# EAGLE design temp_sensor (EAGLE 7.7.0)
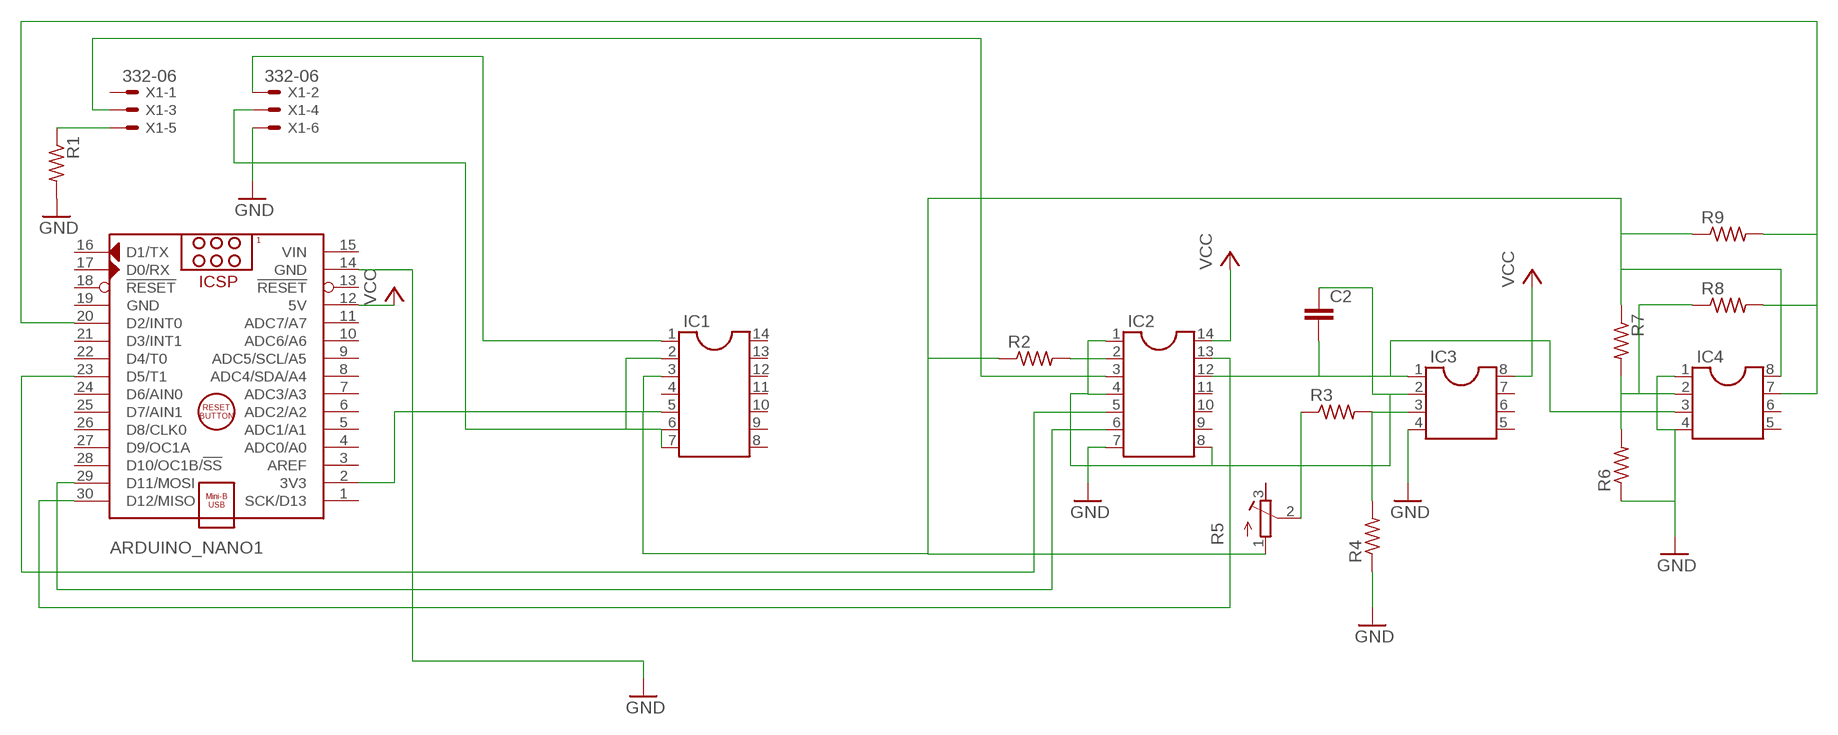
[diagram p0: schematic, sheet 1]

## Parts
ARDUINO_NANO1  ARDUINO_NANO  [ARDUINO_NANO]
C2  C5/2.5  [C5B2.5]
IC1  DIL14  [DIL14]
IC2  DIL14  [DIL14]
IC3  DIL8  [DIL08]
IC4  DIL8  [DIL08]
R1  R-US_0207/10  [0207/10]
R2  R-US_0207/10  [0207/10]
R3  R-US_0207/10  [0207/10]
R4  R-US_0207/10  [0207/10]
R5  R-TRIMM3299W  [RTRIM3299W]
R6  R-US_0207/10  [0207/10]
R7  R-US_0207/10  [0207/10]
R8  R-US_0207/10  [0207/10]
R9  R-US_0207/10  [0207/10]
X1  332-06  [332-06]

## Nets
GND: ARDUINO_NANO1.14(GND) IC2.7 IC3.4 IC4.1 IC4.4 R1.2 R4.1 R6.1 X1.6
N$1: IC1.1 X1.2
N$2: ARDUINO_NANO1.2(3V3) IC1.3 IC1.5 IC4.8 R2.1 R5.1(A) R7.1 R9.1
N$3: IC1.2 IC1.6 IC1.7 X1.4
N$4: ARDUINO_NANO1.23(D5/T1) IC2.5
N$5: R1.1 X1.5
N$6: IC2.3 X1.3
N$7: ARDUINO_NANO1.30(D12/MISO) IC2.13
N$8: ARDUINO_NANO1.29(D11/MOSI) IC2.6
N$9: C2.1 IC2.1 IC2.4 IC2.8 IC3.2
N$10: C2.2 IC2.12 IC3.1 IC4.3
N$11: IC2.2 R2.2
N$12: IC3.3 R3.2 R4.2
N$13: R3.1 R5.2(S)
N$14: IC4.2 R6.2 R7.2 R8.1
N$17: ARDUINO_NANO1.20(D2/INT0) IC4.7 R8.2 R9.2
VCC: ARDUINO_NANO1.12(5V) IC2.14 IC3.8
Unconnected: ARDUINO_NANO1.1(SCK/D13) ARDUINO_NANO1.3(AREF) ARDUINO_NANO1.4(ADC0/A0) ARDUINO_NANO1.5(ADC1/A1) ARDUINO_NANO1.6(ADC2/A2) ARDUINO_NANO1.7(ADC3/A3) ARDUINO_NANO1.8(ADC4/SDA/A4) ARDUINO_NANO1.9(ADC5/SCL/A5) ARDUINO_NANO1.10(ADC6/A6) ARDUINO_NANO1.11(ADC7/A7) ARDUINO_NANO1.13(!RESET) ARDUINO_NANO1.16(D1/TX) ARDUINO_NANO1.17(D0/RX) ARDUINO_NANO1.18(!RESET) ARDUINO_NANO1.21(D3/INT1) ARDUINO_NANO1.22(D4/T0) ARDUINO_NANO1.24(D6/AIN0) ARDUINO_NANO1.25(D7/AIN1) ARDUINO_NANO1.26(D8/CLK0) ARDUINO_NANO1.27(D9/OC1A) ARDUINO_NANO1.28(D10/OC1B/!SS) IC1.4 IC1.8 IC1.9 IC1.10 IC1.11 IC1.12 IC1.13 IC1.14 IC2.9 IC2.10 IC2.11 IC3.5 IC3.6 IC3.7 IC4.5 IC4.6 R5.3(E) X1.1

## Power pins joined to a net without a drawn wire
GND: ARDUINO_NANO1.19(GND)
VIN: ARDUINO_NANO1.15(VIN)

## Library data of the parts
ARDUINO_NANO1 = 6301-temp-sensor-rev1:ARDUINO_NANO: Arduino Nano V3.0 Module Overview: The Arduino Nano is a small, complete, and breadboard-friendly board based on the ATmega328 (Arduino Nano 3.x) or ATmega168 (Arduino Nano 2.x). It has more or less the same functionality of the Arduino Duemilanove, but in a different package. It lacks only a DC power jack, and works with a Mini-B USB cable instead of a standard one. The Nano was designed and is being produced by Gravitech <http://www.gravitech.us/arna30wiatp.html>. General specifications: Item Value Microcontroller Atmel ATmega168 or ATmega328 Operating Voltage (logic level) 5 V Input Voltage (recommended) 7-12 V Input Voltage (limits) 6-20 V Digital I/O Pins 14 (of which 6 provide PWM output) Analog Input Pins 8 DC Current per I/O Pin 40 mA Flash Memory 16 KB (ATmega168) or 32 KB (ATmega328) of which 2 KB used by bootloader SRAM 1 KB (ATmega168) or 2 KB (ATmega328) EEPROM 512 bytes (ATmega168) or 1 KB (ATmega328) Clock Speed 16 MHz Dimensions (Inches) 0.73" x 1.70" Dimensions (mm) 18mm x 45mm Overall height About 9 mm (not including pins) Weigth 5 g Power: The Arduino Nano can be powered via the Mini-B USB connection, 6-20V unregulated external power supply (pin 30), or 5V regulated external power supply (pin 27). The power source is automatically selected to the highest voltage source. Memory: The ATmega168 has 16 KB of flash memory for storing code (of which 2 KB is used for the bootloader); the ATmega328 has 32 KB, (also with 2 KB used for the bootloader). The ATmega168 has 1 KB of SRAM and 512 bytes of EEPROM (which can be read and written with the EEPROM library); the ATmega328 has 2 KB of SRAM and 1 KB of EEPROM. Input and Output: Each of the 14 digital pins on the Nano can be used as an input or output, using pinMode(), digitalWrite(), and digitalRead() functions. They operate at 5 volts. Each pin can provide or receive a maximum of 40 mA and has an internal pull-up resistor (disconnected by default) of 20-50 kOhms. In addition, some pins have specialized functions. Visit Arduino - ArduinoBoardNano <https://www.arduino.cc/en/Main/ArduinoBoardNano>
C2 = capacitor-wima:C: CAPACITOR naming: grid - package width
IC1 IC2 = ic-package:DIL14: Dual In Line / Socket
IC3 IC4 = ic-package:DIL8: Dual In Line / Socket
R1 R2 = resistor:R-US_: RESISTOR, American symbol
R3 R4 R6-R9 = rcl:R-US_: RESISTOR, American symbol
R5 = rcl:R-TRIMM: Trimm resistor
X1 = con-garry:332-06: 6 Pin - 2mm Dual Row Source: www.mpe-connector.de / garry_shortform_2012.pdf

## Net classes
0 default: width 0.305 mm, drill 0.508 mm, clearance 0.254 mm

## Board
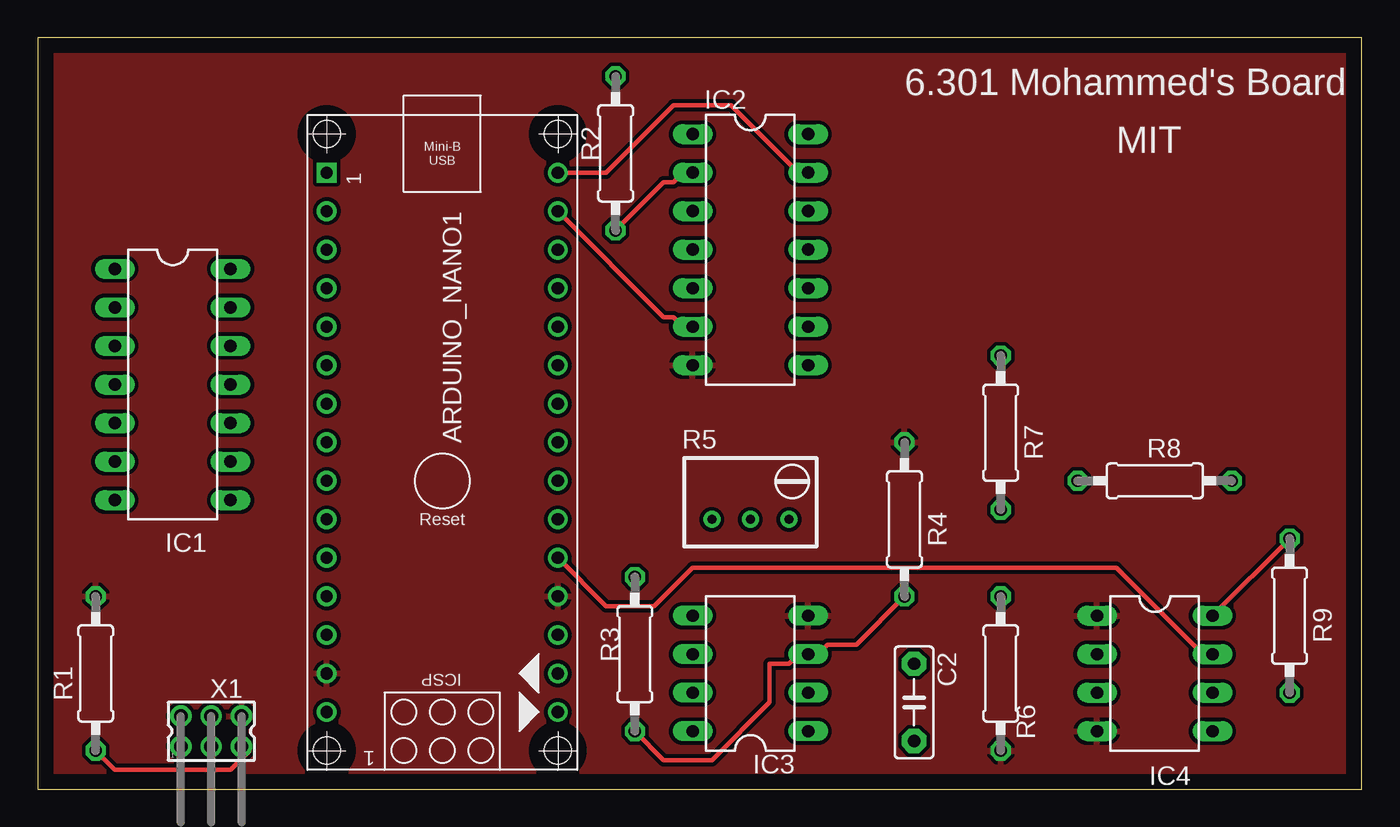
[diagram p1: board, top side]
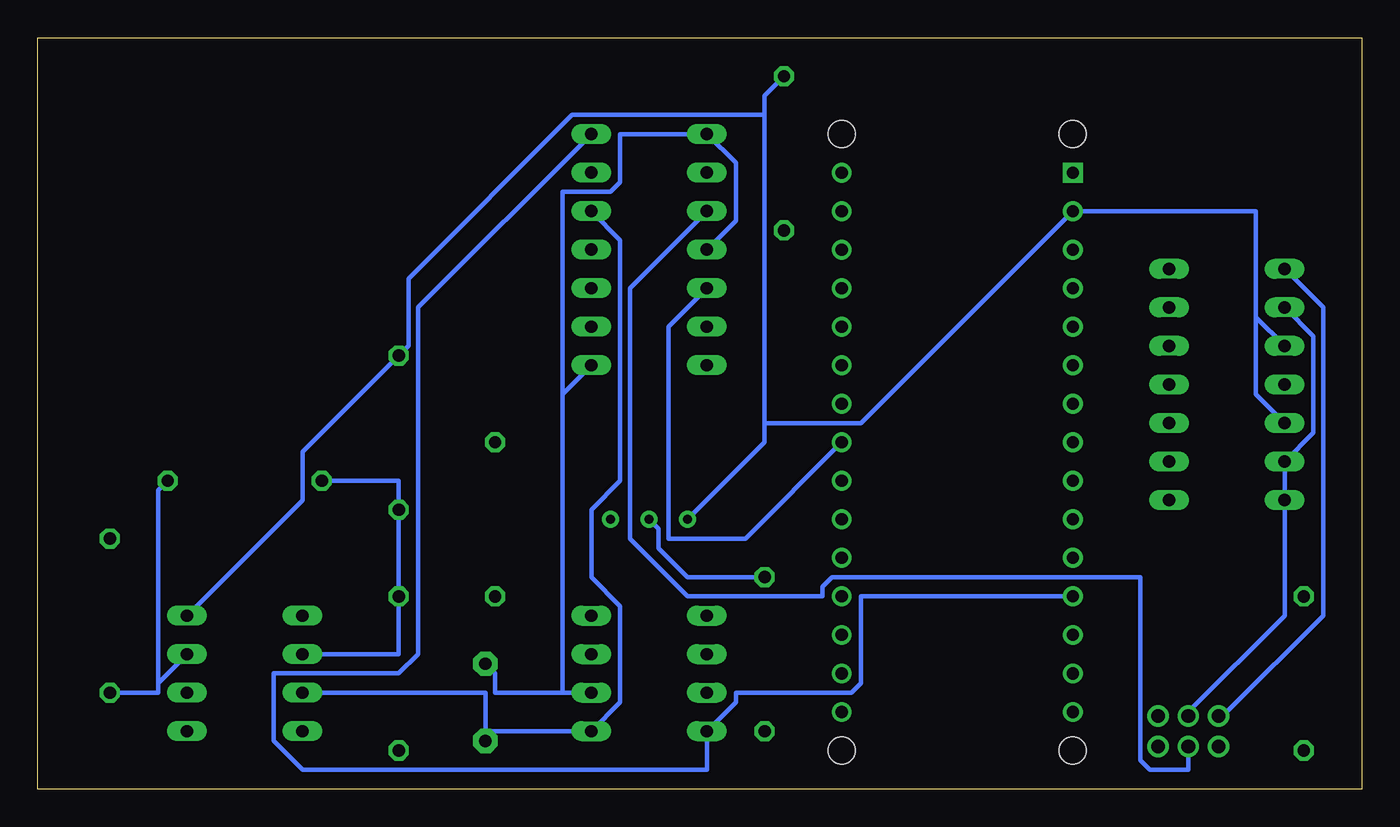
[diagram p2: board, bottom side, seen from below]

Size 87.3 x 49.52 mm. Coordinates in mm from the lower left corner, seen from the top.
Outline: 0,0 87.3,0 87.3,49.52 0,49.52 0,0
Copper layers (1*16): Top 0.035mm / dielectric 1.5mm / Bottom 0.035mm
Design rules "default": minimum track width 10mil, minimum drill 24mil, track to track 8mil, track to pad 8mil, pad to pad 8mil, via to via 8mil, smd to smd 8mil, copper to edge 40mil, drill to drill 8mil, minimum pad ring 10mil, minimum via ring 8mil, stop-mask expansion 4mil, vias tented up to drill 0mil, thermal gap 10mil

### Footprints (pad centres in the part's own frame; a part is rotated, then mirrored left to right if it is on the bottom)
ARDUINO_NANO = drill 0.8 square: 1 -20.32,-7.62 | drill 0.8: 2 -17.78,-7.62; 3 -15.24,-7.62; 4 -12.7,-7.62; 5 -10.16,-7.62; 6 -7.62,-7.62; 7 -5.08,-7.62; 8 -2.54,-7.62; 9 0,-7.62; 10 2.54,-7.62; 11 5.08,-7.62; 12 7.62,-7.62; 13 10.16,-7.62; 14 12.7,-7.62; 15 15.24,-7.62; 16 15.24,7.62; 17 12.7,7.62; 18 10.16,7.62; 19 7.62,7.62; 20 5.08,7.62; 21 2.54,7.62; 22 0,7.62; 23 -2.54,7.62; 24 -5.08,7.62; 25 -7.62,7.62; 26 -10.16,7.62; 27 -12.7,7.62; 28 -15.24,7.62; 29 -17.78,7.62; 30 -20.32,7.62 | hole 1.778: -22.86,-7.62; -22.86,7.62; 17.78,7.62; 17.78,-7.62
C5B2.5 = drill 0.813 pad 1.6 octagon: 1 -2.54,0; 2 2.54,0
DIL14 = drill 0.813 long: 1 -7.62,-3.81; 2 -5.08,-3.81; 3 -2.54,-3.81; 4 0,-3.81; 5 2.54,-3.81; 6 5.08,-3.81; 7 7.62,-3.81; 8 7.62,3.81; 9 5.08,3.81; 10 2.54,3.81; 11 0,3.81; 12 -2.54,3.81; 13 -5.08,3.81; 14 -7.62,3.81
DIL08 = drill 0.813 long: 1 -3.81,-3.81; 2 -1.27,-3.81; 3 1.27,-3.81; 4 3.81,-3.81; 5 3.81,3.81; 6 1.27,3.81; 7 -1.27,3.81; 8 -3.81,3.81
0207/10 = drill 0.813 octagon: 1 -5.08,0; 2 5.08,0
RTRIM3299W = drill 0.61: 1 1.27,-2.54; 2 1.27,0; 3 1.27,2.54
332-06 = drill 0.9 pad 1.27: 1 -2,-1; 2 -2,1; 3 0,-1; 4 0,1; 5 2,-1; 6 2,1

### Placement (x,y rotation side)
ARDUINO_NANO1  26.67,20.32 270 top
C2  57.78,5.71 270 top
IC1  8.89,26.67 270 top
IC2  46.99,35.56 270 top
IC3  46.99,7.62 90 top
IC4  73.66,7.62 270 top
R1  3.81,7.62 90 top
R2  38.1,41.91 270 top
R3  39.37,8.89 270 top
R4  57.15,17.78 270 top
R5  46.99,19.05 270 top
R6  63.5,7.62 90 top
R7  63.5,23.5 270 top
R8  73.66,20.32 0 top
R9  82.55,11.43 270 top
X1  11.43,3.81 0 top

### Tracks (layer width: path | path; a pad name or v marks a point on that pad's centre or on a via)
GND
  pour Top: -1.27,50.8 88.9,50.8 88.9,-1.27 -1.27,-1.27
N$1
  Bottom 0.305: IC1.1 2.54,31.75 2.54,11.43 8.89,5.08 X1.2
N$2
  Top 0.305: IC4.8 R9.1
  Bottom 0.305: IC4.8 69.85,19.05 69.85,22.23 R7.1 62.87,29.21 62.87,33.66 52.07,44.45 39.37,44.45 | 6.99,31.11 6.99,38.1 ARDUINO_NANO1.2 33.02,24.13 39.37,24.13 | IC1.3 6.99,31.11 | IC1.5 6.99,26.04 6.99,31.11 | R5.1 39.37,22.86 39.37,24.13 | 39.37,44.45 39.37,45.72 R2.1 | 39.37,44.45 39.37,24.13
N$3
  Bottom 0.305: IC1.2 3.17,29.84 3.17,23.5 IC1.6 IC1.7 5.08,11.43 11.43,5.08 X1.4
N$4
  Bottom 0.305: ARDUINO_NANO1.23 40.64,16.51 45.72,16.51 45.72,30.48 IC2.5
N$5
  Top 0.305: R1.1 5.08,1.27 12.7,1.27 13.97,2.54 X1.5
N$6
  Bottom 0.305: IC2.3 48.26,33.02 48.26,16.51 44.45,12.7 35.56,12.7 35.56,13.34 34.92,13.97 14.61,13.97 14.61,1.91 13.97,1.27 11.43,1.27 X1.3
N$7
  Top 0.305: ARDUINO_NANO1.30 37.47,40.64 41.91,45.09 45.72,45.09 50.16,40.64 IC2.13
N$8
  Top 0.305: ARDUINO_NANO1.29 41.27,31.11 41.91,31.11 42.55,30.48 IC2.6
N$9
  Bottom 0.305: IC2.4 41.27,37.47 41.27,41.27 IC2.1 48.9,43.18 48.9,40.01 49.53,39.37 52.7,39.37 52.7,26.04 | 52.7,6.35 57.15,6.35 57.15,7.62 C2.1 | 52.7,6.35 IC3.2 | 52.7,26.04 IC2.8 | 52.7,6.35 52.7,26.04
N$10
  Bottom 0.305: 57.78,3.81 IC3.1 48.9,5.71 48.9,12.06 50.8,13.97 50.8,18.41 48.9,20.32 48.9,36.2 IC2.12 | IC4.3 57.78,6.35 57.78,3.81 | 57.78,3.81 C2.2
N$11
  Top 0.305: R2.2 41.27,40.01 41.91,40.01 42.55,40.64 IC2.2
N$12
  Top 0.305: R3.2 41.27,1.91 44.45,1.91 48.26,5.71 48.26,8.26 49.53,8.26 50.16,8.89 IC3.3 51.44,8.89 52.07,9.53 53.98,9.53 R4.2
N$13
  Bottom 0.305: R5.2 46.35,17.14 46.35,15.88 44.45,13.97 R3.1
N$14
  Bottom 0.305: IC4.2 63.5,8.89 R6.2 R7.2 63.5,20.32 R8.1
N$17
  Top 0.305: ARDUINO_NANO1.20 37.47,12.06 40.64,12.06 43.18,14.61 71.12,14.61 76.83,8.89 IC4.7
  Bottom 0.305: R9.2 79.38,6.35 79.38,6.99 | IC4.7 79.38,6.99 | R8.2 79.38,19.68 79.38,6.99
VCC
  Bottom 0.305: ARDUINO_NANO1.12 33.02,12.7 33.02,6.99 33.66,6.35 41.27,6.35 41.27,5.71 IC3.8 43.18,1.27 69.85,1.27 71.75,3.17 71.75,7.62 63.5,7.62 62.23,8.89 62.23,31.75 IC2.14

### Text on the board
tPlace: 6.301 Mohammed's Board | MIT